# EAGLE design STM32F446RC_double layer (EAGLE 9.2.0)
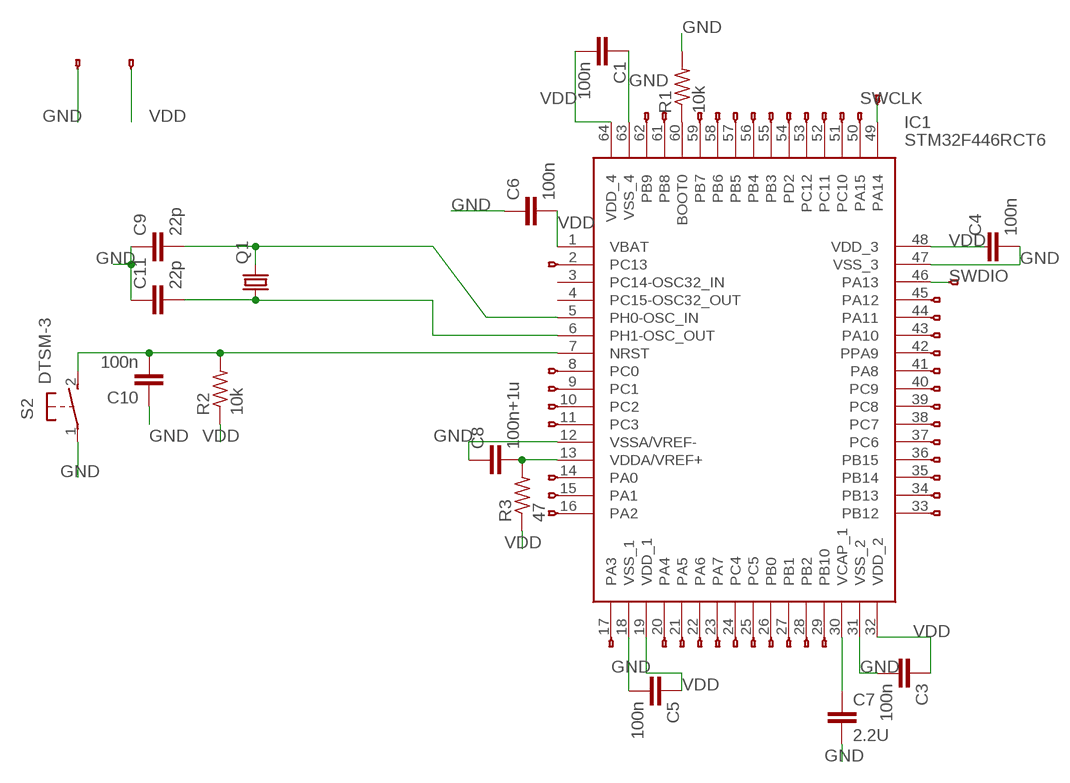
[diagram p0: schematic, sheet 1]

## Parts
C1  100n  C2,5-3  [C2.5-3]
C3  100n  C2,5-3  [C2.5-3]
C4  100n  C2,5-3  [C2.5-3]
C5  100n  C2,5-3  [C2.5-3]
C6  100n  C2,5-3  [C2.5-3]
C7  2.2U  C2,5-3  [C2.5-3]
C8  100n+1u  C2,5-3  [C2.5-3]
C9  22p  C2,5-3  [C2.5-3]
C10  100n  C2,5-3  [C2.5-3]
C11  22p  C2,5-3  [C2.5-3]
IC1  STM32F446RCT6  [QFP50P1200X1200X160-64N]
JP1  HEADERHOLE-HEADERHOLE  [1X1-HEADER-HOLE]
JP2  HEADERHOLE-HEADERHOLE  [1X1-HEADER-HOLE]
JP3  HEADERHOLE-HEADERHOLE  [1X1-HEADER-HOLE]
JP4  HEADERHOLE-HEADERHOLE  [1X1-HEADER-HOLE]
JP5  HEADERHOLE-HEADERHOLE  [1X1-HEADER-HOLE]
JP6  HEADERHOLE-HEADERHOLE  [1X1-HEADER-HOLE]
JP7  HEADERHOLE-HEADERHOLE  [1X1-HEADER-HOLE]
JP8  HEADERHOLE-HEADERHOLE  [1X1-HEADER-HOLE]
JP9  HEADERHOLE-HEADERHOLE  [1X1-HEADER-HOLE]
JP10  HEADERHOLE-HEADERHOLE  [1X1-HEADER-HOLE]
JP11  HEADERHOLE-HEADERHOLE  [1X1-HEADER-HOLE]
JP12  HEADERHOLE-HEADERHOLE  [1X1-HEADER-HOLE]
JP13  HEADERHOLE-HEADERHOLE  [1X1-HEADER-HOLE]
JP14  HEADERHOLE-HEADERHOLE  [1X1-HEADER-HOLE]
JP15  HEADERHOLE-HEADERHOLE  [1X1-HEADER-HOLE]
JP16  HEADERHOLE-HEADERHOLE  [1X1-HEADER-HOLE]
JP17  HEADERHOLE-HEADERHOLE  [1X1-HEADER-HOLE]
JP18  HEADERHOLE-HEADERHOLE  [1X1-HEADER-HOLE]
JP19  HEADERHOLE-HEADERHOLE  [1X1-HEADER-HOLE]
JP21  HEADERHOLE-HEADERHOLE  [1X1-HEADER-HOLE]
JP22  HEADERHOLE-HEADERHOLE  [1X1-HEADER-HOLE]
JP23  HEADERHOLE-HEADERHOLE  [1X1-HEADER-HOLE]
JP24  HEADERHOLE-HEADERHOLE  [1X1-HEADER-HOLE]
JP25  HEADERHOLE-HEADERHOLE  [1X1-HEADER-HOLE]
JP26  HEADERHOLE-HEADERHOLE  [1X1-HEADER-HOLE]
JP27  HEADERHOLE-HEADERHOLE  [1X1-HEADER-HOLE]
JP28  HEADERHOLE-HEADERHOLE  [1X1-HEADER-HOLE]
JP29  HEADERHOLE-HEADERHOLE  [1X1-HEADER-HOLE]
JP30  HEADERHOLE-HEADERHOLE  [1X1-HEADER-HOLE]
JP31  HEADERHOLE-HEADERHOLE  [1X1-HEADER-HOLE]
JP32  HEADERHOLE-HEADERHOLE  [1X1-HEADER-HOLE]
JP33  HEADERHOLE-HEADERHOLE  [1X1-HEADER-HOLE]
JP34  HEADERHOLE-HEADERHOLE  [1X1-HEADER-HOLE]
JP35  HEADERHOLE-HEADERHOLE  [1X1-HEADER-HOLE]
JP36  HEADERHOLE-HEADERHOLE  [1X1-HEADER-HOLE]
JP37  HEADERHOLE-HEADERHOLE  [1X1-HEADER-HOLE]
JP38  HEADERHOLE-HEADERHOLE  [1X1-HEADER-HOLE]
JP39  HEADERHOLE-HEADERHOLE  [1X1-HEADER-HOLE]
JP40  HEADERHOLE-HEADERHOLE  [1X1-HEADER-HOLE]
JP41  HEADERHOLE-HEADERHOLE  [1X1-HEADER-HOLE]
JP42  HEADERHOLE-HEADERHOLE  [1X1-HEADER-HOLE]
JP43  HEADERHOLE-HEADERHOLE  [1X1-HEADER-HOLE]
JP44  HEADERHOLE-HEADERHOLE  [1X1-HEADER-HOLE]
JP45  HEADERHOLE-HEADERHOLE  [1X1-HEADER-HOLE]
JP46  HEADERHOLE-HEADERHOLE  [1X1-HEADER-HOLE]
JP47  HEADERHOLE-HEADERHOLE  [1X1-HEADER-HOLE]
JP54  HEADERHOLE-HEADERHOLE  [1X1-HEADER-HOLE]
JP55  HEADERHOLE-HEADERHOLE  [1X1-HEADER-HOLE]
Q1  CRYSTALHC49S  [HC49/S]
R1  10k  R-US_0204/2V  [0204V]
R2  10k  R-US_0204/2V  [0204V]
R3  47  R-US_0204/2V  [0204V]
S2  DTSM-3  [DTSM-3]

## Nets
GND: C1.1 C3.2 C4.2 C5.2 C6.1 C7.2 C8.1 C9.1 C10.1 C11.1 IC1.12(VSSA/VREF-) IC1.18(VSS_1) IC1.31(VSS_2) IC1.47(VSS_3) IC1.63(VSS_4) JP7.1 R1.2 S2.1
N$2: C8.2 IC1.13(VDDA/VREF+) R3.2
N$3: C10.2 IC1.7(NRST) R2.2 S2.2
N$5: IC1.60(BOOT0) R1.1
N$7: C11.2 IC1.6(PH1-OSC_OUT) Q1.1
N$9: IC1.59(PB7) JP43.1
N$10: IC1.58(PB6) JP42.1
N$11: IC1.24(PC4) JP12.1
N$12: IC1.25(PC5) JP23.1
N$13: IC1.26(PB0) JP22.1
N$14: IC1.27(PB1) JP17.1
N$15: IC1.28(PB2) JP16.1
N$16: IC1.29(PB10) JP14.1
N$17: IC1.23(PA7) JP11.1
N$18: IC1.22(PA6) JP9.1
N$19: IC1.21(PA5) JP19.1
N$20: IC1.17(PA3) JP24.1
N$21: IC1.33(PB12) JP18.1
N$22: IC1.34(PB13) JP13.1
N$23: IC1.35(PB14) JP6.1
N$24: IC1.36(PB15) JP10.1
N$25: IC1.37(PC6) JP1.1
N$26: IC1.16(PA2) JP36.1
N$27: IC1.15(PA1) JP35.1
N$28: IC1.14(PA0) JP34.1
N$29: IC1.11(PC3) JP4.1
N$30: IC1.10(PC2) JP3.1
N$31: IC1.9(PC1) JP27.1
N$32: IC1.8(PC0) JP29.1
N$33: IC1.2(PC13) JP26.1
N$34: IC1.38(PC7) JP15.1
N$35: IC1.39(PC8) JP2.1
N$36: IC1.40(PC9) JP30.1
N$37: IC1.41(PA8) JP28.1
N$38: IC1.42(PPA9) JP31.1
N$39: IC1.43(PA10) JP33.1
N$40: IC1.44(PA11) JP32.1
N$41: IC1.45(PA12) JP25.1
N$42: IC1.57(PB5) JP41.1
N$43: IC1.56(PB4) JP40.1
N$44: IC1.55(PB3) JP44.1
N$45: IC1.54(PD2) JP38.1
N$46: IC1.53(PC12) JP39.1
N$47: IC1.52(PC11) JP5.1
N$48: IC1.51(PC10) JP37.1
N$49: IC1.50(PA15) JP45.1
N$50: IC1.61(PB8) JP46.1
N$51: IC1.62(PB9) JP47.1
N$52: IC1.20(PA4) JP21.1
N$53: C9.2 IC1.5(PH0-OSC_IN) Q1.2
N$66: C7.1 IC1.30(VCAP_1)
SWCLK: IC1.49(PA14) JP55.1
SWDIO: IC1.46(PA13) JP54.1
VDD: C1.2 C3.1 C4.1 C5.1 C6.2 IC1.1(VBAT) IC1.19(VDD_1) IC1.32(VDD_2) IC1.48(VDD_3) IC1.64(VDD_4) JP8.1 R2.1 R3.1
Unconnected: IC1.3(PC14-OSC32_IN) IC1.4(PC15-OSC32_OUT)

## Library data of the parts
C1 C3-C11 = capacitor-wima:C: CAPACITOR naming: grid - package width
IC1 = STM32F446RCT6:STM32F446RCT6: STMICROELECTRONICS - STM32F446RCT6 - MCU, 32BIT, CORTEX-M4, 180MHZ, LQFP-64 Source: Datasheet <https://componentsearchengine.com/Datasheets/1/STM32F446RCT6.pdf>; DESCRIPTION: STMICROELECTRONICS - STM32F446RCT6 - MCU, 32BIT, CORTEX-M4, 180MHZ, LQFP-64; HEIGHT: 1.6mm; MANUFACTURER_NAME: STMicroelectronics; MANUFACTURER_PART_NUMBER: STM32F446RCT6; MOUSER_PART_NUMBER: 511-STM32F446RCT6; MOUSER_PRICE-STOCK: https://www.mouser.com/Search/Refine.aspx?Keyword=511-STM32F446RCT6
JP1-JP19 JP21-JP47 JP54 JP55 = F405Pill:HEADERHOLE
Q1 = crystal:CRYSTAL: CRYSTAL; OC_FARNELL: 1667008; OC_NEWARK: unknown
R1-R3 = rcl:R-US_: RESISTOR, American symbol; SPICEPREFIX: R
S2 = switch-tact:DTSM-3

## Board
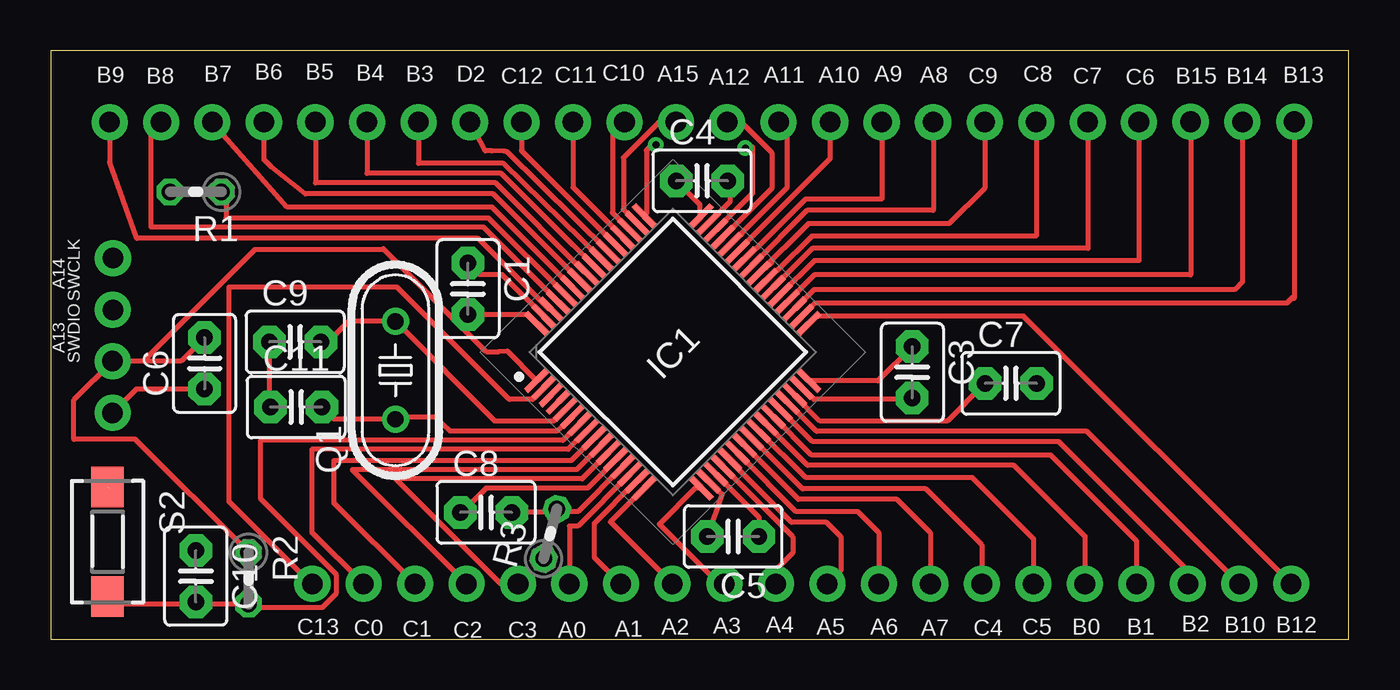
[diagram p1: board, top side]
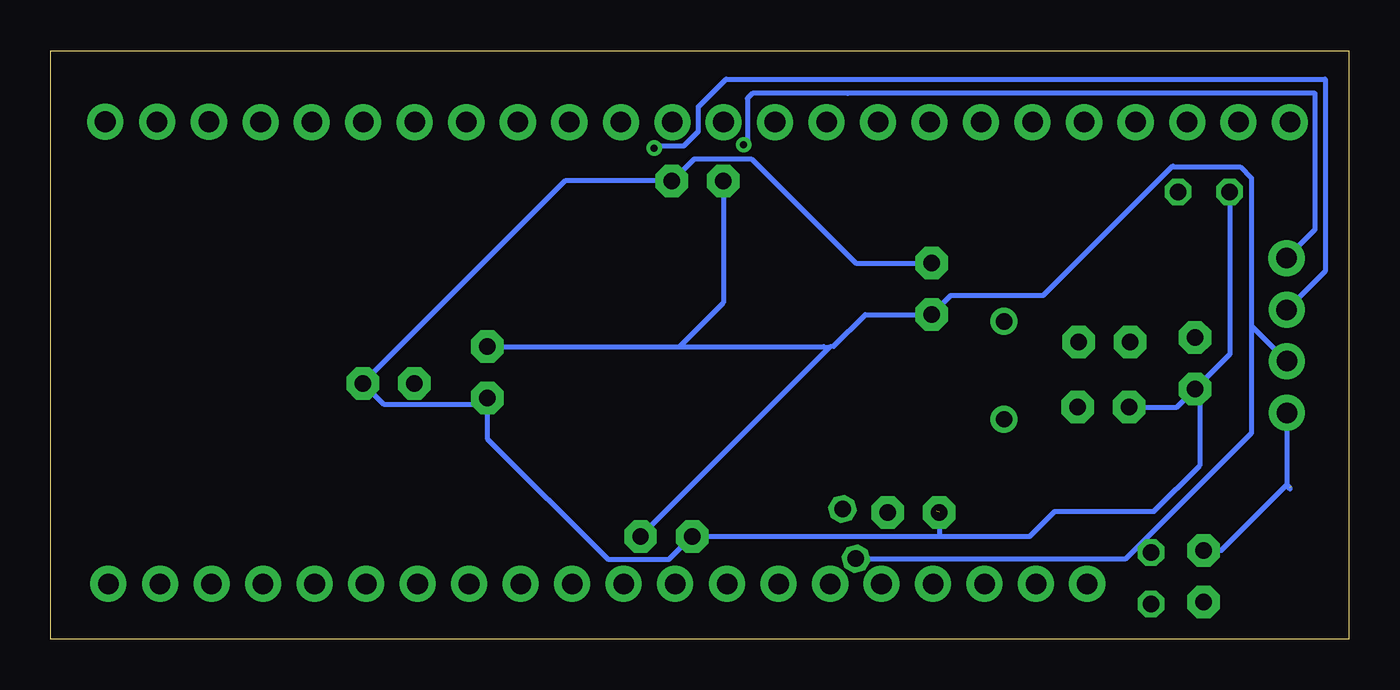
[diagram p2: board, bottom side, seen from below]

Size 64 x 29 mm. Coordinates in mm from the lower left corner, seen from the top.
Outline: 0,0 64,0 64,29 0,29 0,0
Copper layers (1*16): Top 0.035mm / dielectric 1.5mm / Bottom 0.035mm
Design rules "default": minimum track width 6mil, minimum drill 0.35mm, track to track 6mil, track to pad 6mil, pad to pad 6mil, via to via 6mil, smd to smd 6mil, copper to edge 40mil, drill to drill 6mil, minimum pad ring 10mil, minimum via ring 8mil, stop-mask expansion 4mil, vias tented up to drill 0mil, thermal gap 10mil

### Footprints (pad centres in the part's own frame; a part is rotated, then mirrored left to right if it is on the bottom)
C2.5-3 = drill 0.813 pad 1.6 octagon: 1 -1.27,0; 2 1.27,0
QFP50P1200X1200X160-64N = smd 1.475 x 0.3: 1 -5.738,3.75; 2 -5.738,3.25; 3 -5.738,2.75; 4 -5.738,2.25; 5 -5.738,1.75; 6 -5.738,1.25; 7 -5.738,0.75; 8 -5.738,0.25; 9 -5.738,-0.25; 10 -5.738,-0.75; 11 -5.738,-1.25; 12 -5.738,-1.75; 13 -5.738,-2.25; 14 -5.738,-2.75; 15 -5.738,-3.25; 16 -5.738,-3.75; 33 5.738,-3.75; 34 5.738,-3.25; 35 5.738,-2.75; 36 5.738,-2.25; 37 5.738,-1.75; 38 5.738,-1.25; 39 5.738,-0.75; 40 5.738,-0.25; 41 5.738,0.25; 42 5.738,0.75; 43 5.738,1.25; 44 5.738,1.75; 45 5.738,2.25; 46 5.738,2.75; 47 5.738,3.25; 48 5.738,3.75 | smd 0.3 x 1.475: 17 -3.75,-5.738; 18 -3.25,-5.738; 19 -2.75,-5.738; 20 -2.25,-5.738; 21 -1.75,-5.738; 22 -1.25,-5.738; 23 -0.75,-5.738; 24 -0.25,-5.738; 25 0.25,-5.738; 26 0.75,-5.738; 27 1.25,-5.738; 28 1.75,-5.738; 29 2.25,-5.738; 30 2.75,-5.738; 31 3.25,-5.738; 32 3.75,-5.738; 49 3.75,5.738; 50 3.25,5.738; 51 2.75,5.738; 52 2.25,5.738; 53 1.75,5.738; 54 1.25,5.738; 55 0.75,5.738; 56 0.25,5.738; 57 -0.25,5.738; 58 -0.75,5.738; 59 -1.25,5.738; 60 -1.75,5.738; 61 -2.25,5.738; 62 -2.75,5.738; 63 -3.25,5.738; 64 -3.75,5.738
1X1-HEADER-HOLE = drill 1.016 pad 1.778: 1 0,0
HC49/S = drill 0.813: 1 -2.413,0; 2 2.413,0
0204V = drill 0.813 octagon: 1 -1.27,0; 2 1.27,0
DTSM-3 = smd 2 x 1.6: 1 -2.7,0; 2 2.7,0

### Placement (x,y rotation side)
C1  20.57,17.26 270 top
C3  42.48,13.15 270 top
C4  32.11,22.59 0 top
C5  33.65,5.06 180 top
C6  7.59,13.59 90 top
C7  47.34,12.61 0 top
C8  21.46,6.25 0 top
C9  12.05,14.65 0 top
C10  7.15,3.1 270 top
C11  12.1,11.44 0 top
IC1  30.67,14.15 45 top
JP1  53.65,25.48 0 top
JP2  48.59,25.48 0 top
JP3  20.5,2.72 0 top
JP4  23.04,2.72 0 top
JP5  25.75,25.48 0 top
JP6  58.76,25.49 0 top
JP7  3.05,11.15 0 top
JP8  3.05,13.7 0 top
JP9  40.83,2.72 0 top
JP10  56.2,25.5 0 top
JP11  43.37,2.72 0 top
JP12  45.91,2.72 0 top
JP13  61.31,25.5 0 top
JP14  58.61,2.72 0 top
JP15  51.13,25.48 0 top
JP16  56.07,2.72 0 top
JP17  53.53,2.72 0 top
JP18  61.16,2.72 0 top
JP19  38.29,2.72 0 top
JP21  35.75,2.72 0 top
JP22  50.99,2.72 0 top
JP23  48.45,2.72 0 top
JP24  33.21,2.72 0 top
JP25  33.35,25.48 0 top
JP26  12.9,2.72 0 top
JP27  17.96,2.72 0 top
JP28  43.51,25.48 0 top
JP29  15.42,2.72 0 top
JP30  46.05,25.48 0 top
JP31  40.97,25.48 0 top
JP32  35.89,25.48 0 top
JP33  38.43,25.48 0 top
JP34  25.57,2.72 0 top
JP35  28.11,2.72 0 top
JP36  30.65,2.72 0 top
JP37  28.29,25.48 0 top
JP38  20.67,25.48 0 top
JP39  23.21,25.48 0 top
JP40  15.59,25.48 0 top
JP41  13.05,25.48 0 top
JP42  10.51,25.48 0 top
JP43  7.97,25.48 0 top
JP44  18.13,25.48 0 top
JP45  30.83,25.48 0 top
JP46  5.44,25.48 0 top
JP47  2.9,25.48 0 top
JP54  3.06,16.23 0 top
JP55  3.07,18.78 90 top
Q1  17,13.25 90 top
R1  7.15,22.04 180 top
R2  9.75,3 270 top
R3  24.63,5.19 75 top
S2  2.8,4.8 270 top

### Tracks (layer width: path | path; a pad name or v marks a point on that pad's centre or on a via)
GND  (2 unrouted)
  Top 0.152: 37.63,11.81 37.17,12.27 IC1.31 | 42.53,11.88 C3.2 | IC1.63 24.22,15.93 | 20.57,18.48 C1.1 20.57,18.63 | 27.72,8.77 IC1.12 27.82,8.86
  Top 0.254: IC1.47 33.48,21.56 33.48,22.49 C4.2 | C3.2 42.41,11.81 37.63,11.81 | C9.1 10.78,11.49 C11.1 | C1.1 21.14,17.96 22.26,17.96 IC1.63 | IC1.18 32.45,7.79 33.1,7.14 C5.2 | IC1.12 27.77,8.78 27.77,8.74 26.47,7.44 21.46,7.44 20.33,6.3 | C6.1 4.22,12.32 JP7.1
  Bottom 0.152: 20.17,5.06 20.16,5.07 | C4.2 33.34,22.59
  Bottom 0.254: C11.1 8.47,11.44 C6.1 | C8.1 20.19,5.07 20.16,5.07 15.73,5.07 14.5,6.3 9.6,6.3 7.35,8.55 7.35,12.08 C6.1 | 20.17,5.06 C5.2 33.48,3.96 33.48,3.94 36.53,3.94 42.48,9.88 C3.2 42.78,11.58 47.58,11.58 C7.2 38.63,22.59 C4.2 | 33.34,22.59 32.27,23.67 29.45,23.67 24.31,18.53 C1.1 20.68,18.42 | C6.1 5.86,14.05 5.86,22.02 R1.2 | C10.1 6.28,4.37 3.05,7.6 2.9,7.45 2.9,7.4 3.05,7.55 JP7.1
N$2
  Top 0.152: IC1.13 28.18,8.46 | 25.09,6.29 R3.2
  Top 0.254: IC1.13 25.99,6.29 25.09,6.29 | R3.2 24.79,6.25 C8.2
N$3
  Top 0.152: IC1.7 26.05,10.59
  Top 0.254: IC1.7 25.26,9.8 10.33,9.8 10.33,6.94 14.07,3.2 14.07,2.24 13.38,1.55 9.93,1.55 R2.2 7.45,1.73 7.25,1.73 | 7.25,1.73 C10.2 | 7.25,1.73 3.17,1.73 S2.2
N$5
  Top 0.152: IC1.60 25.29,17
  Top 0.254: R1.1 8.65,21.81 8.65,20.75 21.59,20.75 IC1.60
N$7
  Top 0.254: IC1.6 25.56,10.76 24.96,10.25 19.69,10.25 18.94,10.95 17.11,10.95 Q1.1 13.97,10.84 C11.2 13.83,10.98
N$9
  Top 0.152: IC1.59 25.59,17.45
  Top 0.254: JP43.1 11.66,21.29 21.76,21.29 IC1.59
N$10
  Top 0.152: IC1.58 26.05,17.76
  Top 0.254: JP42.1 10.51,23.65 10.89,23.26 12.55,21.95 21.81,21.95 IC1.58
N$11
  Top 0.254: IC1.24 37.07,7.4 43.15,7.4 45.91,4.64 JP12.1
N$12
  Top 0.254: IC1.25 37.24,7.96 45.45,7.96 48.45,4.96 JP23.1
N$13
  Top 0.254: IC1.26 37.32,8.56 47.5,8.56 50.99,5.07 JP22.1
N$14
  Top 0.152: 35.65,10.9 IC1.27
  Top 0.254: IC1.27 37.52,9.07 49.3,9.07 53.53,4.84 JP17.1
N$15
  Top 0.152: 36.11,11.2 IC1.28
  Top 0.254: IC1.28 37.56,9.73 49.7,9.73 56.07,3.36 JP16.1
N$16
  Top 0.152: 36.41,11.66 IC1.29
  Top 0.254: IC1.29 37.76,10.24 51.09,10.24 JP14.1
N$17
  Top 0.152: 34.28,9.53 IC1.23
  Top 0.254: IC1.23 36.87,6.89 41.73,6.89 43.37,5.25 JP11.1
N$18
  Top 0.152: 33.97,9.07 IC1.22
  Top 0.254: 33.97,9.07 36.76,6.29 39.79,6.29 40.83,5.25 JP9.1
N$19
  Top 0.152: 33.52,8.77 IC1.21
  Top 0.254: JP19.1 38.95,3.38 38.95,5.05 38.25,5.75 36.53,5.75 33.52,8.77
N$20
  Top 0.152: IC1.17 31.99,7.39
  Top 0.254: IC1.17 31.78,7.44 30.01,5.67 32.96,2.72 JP24.1
N$21
  Top 0.152: 37.91,15.92 IC1.33
  Top 0.254: JP18.1 47.96,15.92 37.91,15.92
N$22
  Top 0.152: IC1.34 37.19,16.07 37.19,16.09 | 61.31,16.8 61.25,16.86
  Top 0.254: JP13.1 61.31,16.8 | IC1.34 37.68,16.56 60.95,16.56 61.25,16.86
N$23
  Top 0.152: 36.77,16.39 IC1.35
  Top 0.254: IC1.35 37.64,17.23 58.38,17.23 58.76,17.61 JP6.1
N$24
  Top 0.152: 36.41,16.69 IC1.36
  Top 0.254: IC1.36 37.65,17.95 56.2,17.95 JP10.1
N$25
  Top 0.152: 36.11,17 IC1.37
  Top 0.254: IC1.37 37.65,18.66 53.65,18.66 JP1.1
N$26
  Top 0.254: IC1.16 27.6,5.77 JP36.1
N$27
  Top 0.152: IC1.15 28.79,7.7
  Top 0.254: 28.79,7.7 26.81,5.72 26.81,4.02 JP35.1
N$28
  Top 0.152: IC1.14 28.56,8.12 28.52,8.11
  Top 0.254: 28.52,8.11 25.99,5.57 25.57,5.57 JP34.1
N$29
  Top 0.254: IC1.11 26.36,8.07 26.2,7.9 17.01,7.9 22.19,2.72 JP4.1
N$30
  Top 0.152: 27.27,9.68 IC1.10
  Top 0.254: IC1.10 25.93,8.35 14.87,8.35 JP3.1
N$31
  Top 0.152: IC1.9 26.66,9.83
  Top 0.254: IC1.9 25.73,8.86 25.66,8.8 13.96,8.8 13.96,6.72 JP27.1
N$32
  Top 0.254: JP29.1 12.87,5.27 12.87,9.35 25.52,9.35 IC1.8
N$33
  Top 0.152: IC1.2 24.22,12.27
  Top 0.254: 24.22,12.27 23.76,11.81 22.61,11.81 17.07,17.35 8.78,17.35 8.78,6.79 12.85,2.72
N$34
  Top 0.152: 35.65,17.45 IC1.38
  Top 0.254: IC1.38 37.55,19.26 51.15,19.26 51.13,19.28 JP15.1
N$35
  Top 0.152: 35.34,17.76 IC1.39
  Top 0.254: IC1.39 35.76,18.18 35.83,18.18 37.52,19.87 48.59,19.87 JP2.1
N$36
  Top 0.152: 35.28,18.3 35.04,18.06 IC1.40 35.35,18.5 35.41,18.44
  Top 0.254: 35.56,18.58 35.41,18.44 35.28,18.3 | IC1.40 37.35,20.48 44.3,20.48 46.05,22.23 JP30.1
N$37
  Top 0.152: 43.59,25.56 JP28.1
  Top 0.254: IC1.41 37.3,21.13 43.51,21.13 JP28.1
N$38
  Top 0.254: IC1.42 34.7,19.24 34.77,19.24 37.22,21.69 40.97,21.69 JP31.1
N$39
  Top 0.152: IC1.43 33.82,18.98
  Top 0.254: JP33.1 38.43,23.68 IC1.43
  Bottom 0.152: JP33.1 38.43,25.43
N$40
  Top 0.254: 34.06,19.95 33.99,19.95 IC1.44 36.29,22.25 36.29,25.08 JP32.1
N$41
  Top 0.254: JP25.1 34.05,25.48 35.55,23.98 35.55,22.21 IC1.45
N$42
  Top 0.152: IC1.57 26.35,18.06
  Top 0.254: JP41.1 13.05,22.49 21.92,22.49 26.35,18.06
N$43
  Top 0.152: IC1.56 26.66,18.52
  Top 0.254: JP40.1 15.59,22.95 22.21,22.95 25.76,19.41 25.76,19.4 26.71,18.48 IC1.56
N$44
  Top 0.152: IC1.55 27.11,18.82
  Top 0.254: JP44.1 18.13,23.45 22.31,23.45 IC1.55
N$45
  Top 0.152: IC1.54 27.42,19.13 | 22.43,24.03 22.35,24 22.35,24.05
  Top 0.254: JP38.1 21.42,24.07 21.75,24.07 22.35,24.05 22.38,24.05 | IC1.54 22.5,24.03 22.43,24.03
N$46
  Top 0.152: IC1.53 27.72,19.59
  Top 0.254: JP39.1 23.21,24.08 IC1.53
N$47
  Top 0.152: IC1.52 28.2,19.82
  Top 0.254: 28.2,19.82 25.75,22.27 JP5.1
N$48
  Top 0.152: IC1.51 28.49,20.2
  Top 0.254: IC1.51 27.69,21.02 27.69,25.13 28.04,25.48 JP37.1
N$49
  Top 0.254: JP45.1 29.98,25.48 28.23,23.73 28.23,21.19 IC1.50
N$50
  Top 0.152: IC1.61 24.98,16.69
  Top 0.254: IC1.61 21.34,20.3 4.94,20.3 4.94,24.98 JP46.1
N$51
  Top 0.254: JP47.1 2.9,23.51 4.25,19.75 21.08,19.75 24.57,16.26 IC1.62
N$52
  Top 0.152: 33.21,8.46 IC1.20
  Top 0.254: IC1.20 35.89,5.74 36.59,5.04 36.59,4.26 35.75,3.42 JP21.1
N$53
  Top 0.152: IC1.5 25.29,11.2
  Top 0.254: IC1.5 24.8,10.75 21.91,10.75 Q1.2 14.7,15.66 13.69,14.65 C9.2
N$66
  Top 0.152: 36.72,11.97 IC1.30
  Top 0.254: 36.72,11.97 37.93,10.75 44.21,10.75 C7.1
SWCLK  (via drill 0.35)
  Top 0.152: IC1.49 29.25,20.96
  Top 0.254: IC1.49 29.36,20.96 29.36,24.09 29.74,24.46
  Bottom 0.254: JP55.1 1.67,20.18 1.67,26.9 24.7,26.9 29.4,26.9 29.65,26.65 29.65,24.55 v29.84,24.36
SWDIO  (via drill 0.35)
  Top 0.254: IC1.46 34.6,21.97 34.6,24.25
  Bottom 0.254: JP54.1 1.16,18.13 1.16,27.6 30.7,27.6 32.08,26.22 32.08,25.02 32.8,24.3 34.15,24.3 v34.25,24.2
VDD
  Top 0.152: IC1.48 31.99,20.96 | 37.48,12.73 IC1.32 | IC1.1 23.91,12.88 | IC1.64 23.91,15.47 | 20.57,16.04 C1.2 | 32.91,8 IC1.19 | C6.2 7.54,14.81 7.48,14.75
  Top 0.254: C4.1 31.99,21.44 31.99,20.96 | 37.48,12.73 40.79,12.73 C3.1 | IC1.1 22.51,14.19 22.1,14.17 21.48,14.17 16.4,19.25 16.35,19.2 10.06,19.2 4.56,13.7 JP8.1 | IC1.64 23.54,15.98 23.48,15.99 C1.2 | IC1.19 34.92,6.01 C5.1 | 3.15,13.8 JP8.1 | JP8.1 6.43,13.7 7.54,14.81 | R2.1 4.17,9.85 1.14,9.85 1.14,11.79 JP8.1
  Bottom 0.152: 20.57,16.04 C1.2 | 25.88,14.42 25.88,14.43 25.55,14.43 25.41,14.43
  Bottom 0.254: 3.05,13.6 JP8.1 4.8,15.45 | 8.72,23.27 15.06,16.94 19.62,16.94 C1.2 23.84,15.99 25.41,14.43 | 8.72,23.27 8.67,23.33 | C5.1 25.55,14.43 | C3.1 33,14.42 | 33,14.42 25.88,14.42 | C4.1 30.84,16.58 33,14.42 | 8.72,23.27 5.35,23.27 4.8,22.73 4.8,15.45 | R3.1 10.99,3.96 4.8,10.15 4.8,15.45

### Text on the board
tPlace: B6 | B5 | B4 | C10 | B9 | B8 | B7 | B3 | D2 | C12 | C11 | A15 | A12 | A11 | A10 | A9 | A8 | C9 | C8 | C7 | C6 | B15 | B14 | B13 | A14 | SWCLK | A13 | SWDIO | C13 | C0 | C1 | C2 | C3 | A0 | A1 | A2 | A3 | A4 | A5 | A6 | A7 | C4 | C5 | B0 | B1 | B2 | B10 | B12